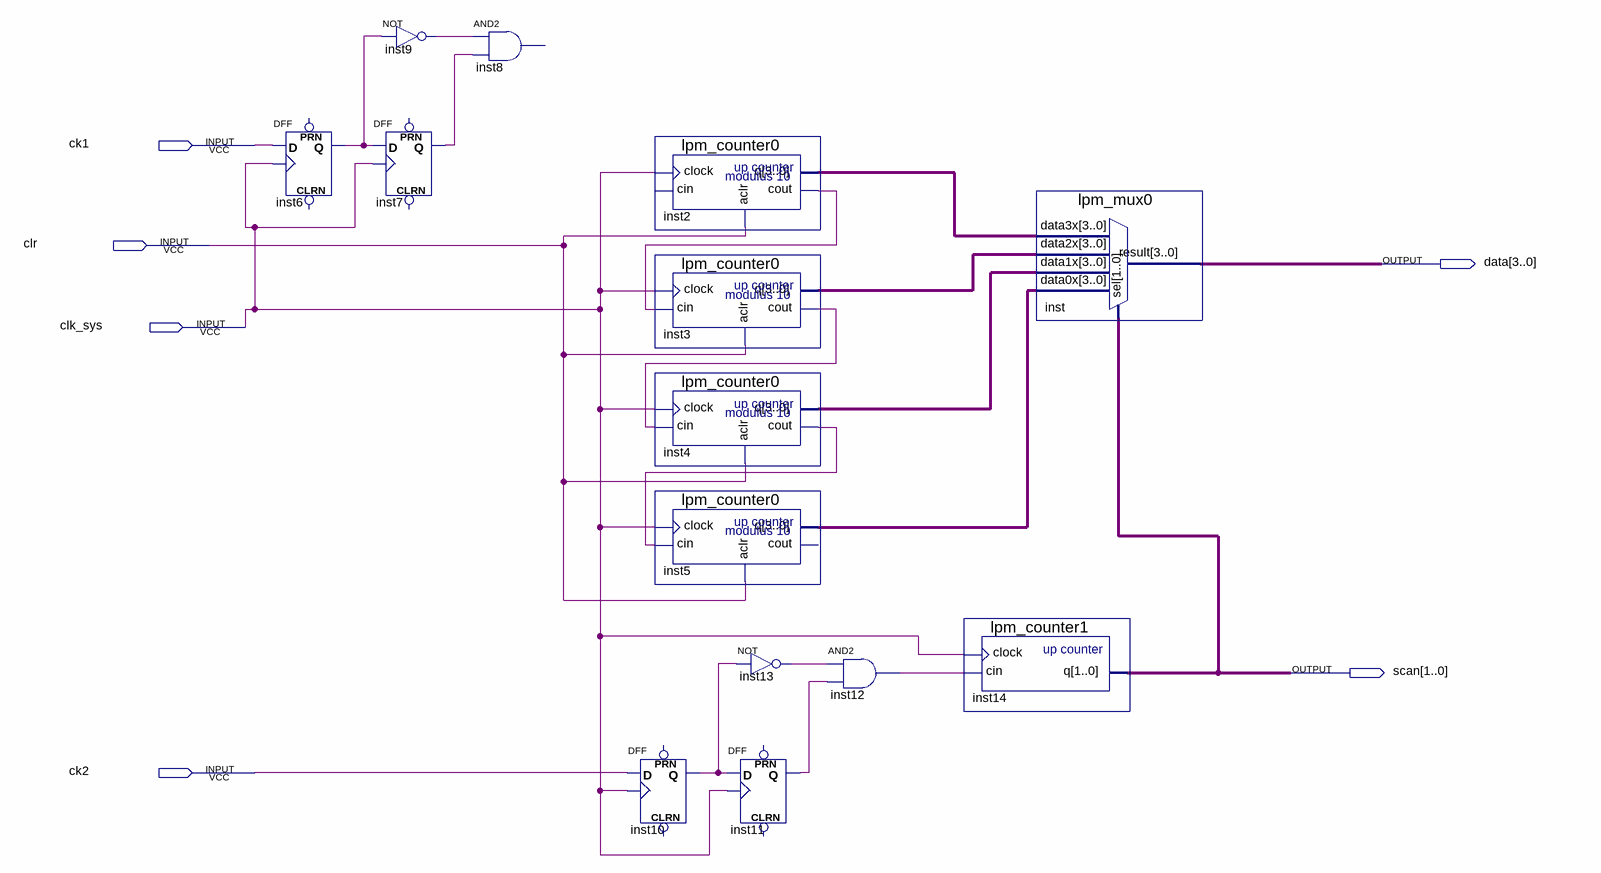
[diagram p0: schematic sheet]
// Quartus schematic LED.bdf as structural Verilog: 14 symbols, 6 pins
module LED (
  input  ck1,
  input  clr,
  input  clk_sys,
  input  ck2,
  output [3:0] data,
  output [1:0] scan
);

  wire inst2_cout, inst3_cout, inst4_cout, inst6_q, inst7_q, inst9_out, inst10_q, inst11_q, inst12_out,
       inst13_out;
  wire [3:0] inst2_q, inst3_q, inst4_q, inst5_q;

  DFF inst6 (.CLK(clk_sys), .D(ck1), .Q(inst6_q));  // open: CLRN, PRN
  not inst9 (inst9_out, inst6_q);
  DFF inst7 (.CLK(clk_sys), .D(inst6_q), .Q(inst7_q));  // open: CLRN, PRN
  // AND2 inst8 has open pins: IN1=inst9_out, IN2=inst7_q, OUT=open
  DFF inst10 (.CLK(clk_sys), .D(ck2), .Q(inst10_q));  // open: CLRN, PRN
  lpm_counter0 inst2 (.clock(clk_sys), .aclr(clr), .cout(inst2_cout), .q(inst2_q));  // open: cin
  lpm_counter0 inst3 (.clock(clk_sys), .cin(inst2_cout), .aclr(clr), .cout(inst3_cout), .q(inst3_q));
  lpm_counter0 inst4 (.clock(clk_sys), .cin(inst3_cout), .aclr(clr), .cout(inst4_cout), .q(inst4_q));
  lpm_counter0 inst5 (.clock(clk_sys), .cin(inst4_cout), .aclr(clr), .q(inst5_q));  // open: cout
  not inst13 (inst13_out, inst10_q);
  DFF inst11 (.CLK(clk_sys), .D(inst10_q), .Q(inst11_q));  // open: CLRN, PRN
  and inst12 (inst12_out, inst13_out, inst11_q);
  lpm_counter1 inst14 (.clock(clk_sys), .cin(inst12_out), .q(scan));
  lpm_mux0 inst (.data3x(inst2_q), .data2x(inst3_q), .data1x(inst4_q), .data0x(inst5_q), .sel(scan), .result(data));
endmodule
